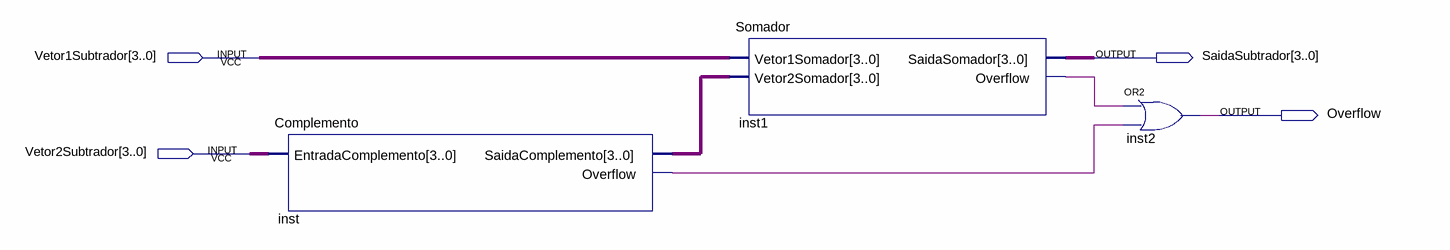
[diagram p0: schematic sheet]
// Quartus schematic Subtrador.bdf as structural Verilog: 3 symbols, 4 pins
module Subtrador (
  input  [3:0] Vetor1Subtrador,
  input  [3:0] Vetor2Subtrador,
  output [3:0] SaidaSubtrador,
  output Overflow
);

  wire inst1_overflow, inst_overflow;
  wire [3:0] inst_saidacomplemento;

  Complemento inst (
    .EntradaComplemento(Vetor2Subtrador), .SaidaComplemento(inst_saidacomplemento), .Overflow(inst_overflow));
  Somador inst1 (
    .Vetor1Somador(Vetor1Subtrador), .Vetor2Somador(inst_saidacomplemento), .SaidaSomador(SaidaSubtrador),
    .Overflow(inst1_overflow));
  or inst2 (Overflow, inst1_overflow, inst_overflow);
endmodule
